# Altium project Super_Hornet_1.0.PrjPcb (part 4 of 5)
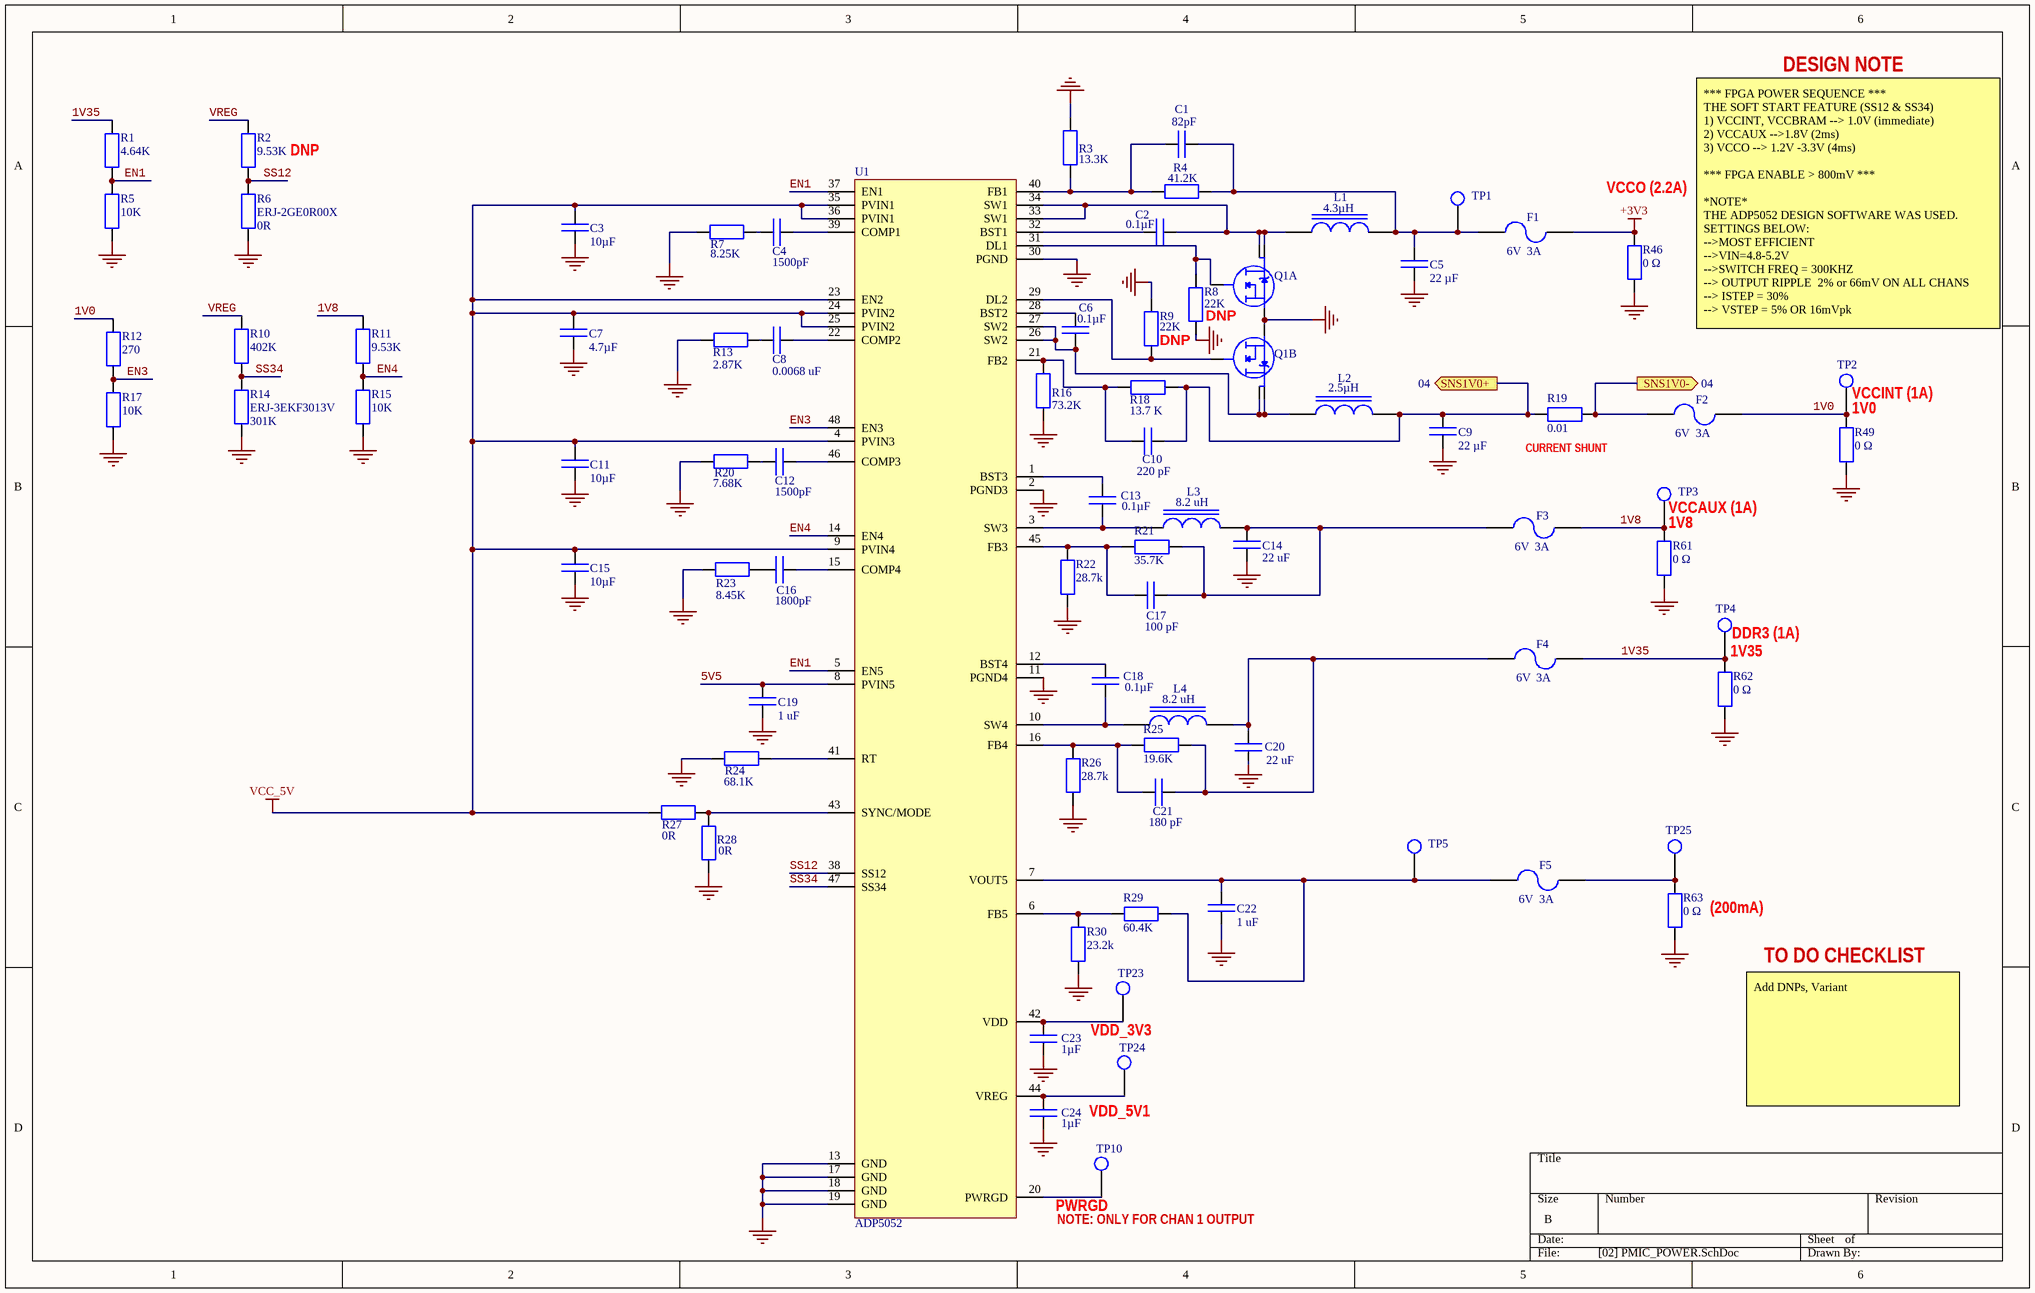
[diagram p5: [02] PMIC_POWER.SchDoc]

## Sheet [02] PMIC_POWER.SchDoc (continued)
### Library data of the parts
C1 = GCM1555C1H820FA16D: CAP CER 82PF 50V C0G/NP0 0402; Manufacturer: Murata; Categories: Capacitors; Tolerance: ±1%; Temperature Coefficient: C0G, NP0; Supplier 1: Digi-Key; Manufacturer Part Number: GCM1555C1H820FA16D; Stock 1: 81409; Pricing 1: 1=0.13, 10=0.095, 100=0.0445, 500=0.0312, 1000=0.0258, 2500=0.024, 5000=0.022 (USD); Series: GCM; Packaging: Digi-Reel®; Part Status: Active; Voltage - Rated: 50V; Operating Temperature: -55°C ~ 125°C; Features: -; Ratings: AEC-Q200; Applications: Automotive; Failure Rate: -; Mounting Type: Surface Mount, MLCC; Package / Case: 0402 (1005 Metric); Size / Dimension: 0.039 L x 0.020 W (1.00mm x 0.50mm); Height - Seated (Max): -; Thickness (Max): 0.022 (0.55mm); Lead Spacing: -; Lead Style: -; ComponentLink1URL: http://search.murata.co.jp/Ceramy/image/img/A01X/G101/ENG/GCM1555C1H820FA16-01.pdf?src-supplier=Digi-Key; ComponentLink1Description: http://search.murata.co.jp/Ceramy/image/img/A01X/G101/ENG/GCM1555C1H820FA16-01.pdf?src-supplier=Digi-Key; Supplier Part Number 1: 490-16436-1-ND
C2 C6 C13 C18 = CC0402KRX7R6BB104: 0402 0.1 uF 10 V ±10 % Tolerance X7R SMT Multilayer Ceramic Capacitor; Manufacturer: Yageo; Product Training Modules: Multilayer Ceramic Capacitors; Catalog Drawings: CC_0402; Featured Product: Commodity Multilayer Ceramic Capacitors – CC Series; Tolerance: ±10%; Voltage - Rated: 10V; Online Catalog: CC Series; Other Names: 311-1345-6; Supplier 1: Digi-Key; Manufacturer Part Number: CC0402KRX7R6BB104; Stock 1: 1324566; Pricing 1: 1=0.1, 10=0.03, 100=0.0134, 500=0.0096, 1000=0.0075, 2500=0.0069, 5000=0.0063 (USD); Standard Package: 1; Category: Capacitors; Family: Ceramic Capacitors; Series: CC; Packaging: Digi-Reel®; Temperature Coefficient: X7R; Mounting Type: Surface Mount, MLCC; Operating Temperature: -55°C ~ 125°C; Applications: General Purpose; Ratings: -; Package / Case: 0402 (1005 Metric); Size / Dimension: 0.039" L x 0.020" W (1.00mm x 0.50mm); Height - Seated (Max): -; Thickness (Max): 0.022" (0.55mm); Lead Spacing: -; Features: -; Lead Style: -; ComponentLink1URL: http://www.mouser.com/ds/2/447/Yageo_UPY-GP_NP0_16V-to-50V_9-358835.pdf?src-supplier=Mouser; ComponentLink1Description: http://www.mouser.com/ds/2/447/Yageo_UPY-GP_NP0_16V-to-50V_9-358835.pdf?src-supplier=Mouser; ComponentLink2URL: https://www.verical.com/server-webapp/html/getDatasheet?partID=317655&src-supplier=Verical; ComponentLink2Description: https://www.verical.com/server-webapp/html/getDatasheet?partID=317655&src-supplier=Verical; ComponentLink3URL: http://www.farnell.com/datasheets/2167236.pdf?src-supplier=Element14; ComponentLink3Description: http://www.farnell.com/datasheets/2167236.pdf?src-supplier=Element14; ComponentLink4URL: http://www.yageo.com/documents/recent/UPY-GPHC_X7R_6.3V-to-50V_18.pdf?src-supplier=Digi-Key; ComponentLink4Description: http://www.yageo.com/documents/recent/UPY-GPHC_X7R_6.3V-to-50V_18.pdf?src-supplier=Digi-Key; ComponentLink5URL: http://www.yageo.com/documents/recent/UPY-GPHC_X7R_6.3V-to-50V_8.pdf?src-supplier=Avnet+Europe; ComponentLink5Description: http://www.yageo.com/documents/recent/UPY-GPHC_X7R_6.3V-to-50V_8.pdf?src-supplier=Avnet+Europe; Supplier Part Number 1: 311-1345-1-ND
C3 C11 C15 = C3216X5R1C106M160AA: CAP CER 10UF 16V X5R 1206; Manufacturer: TDK; PCN Part Number: MLCC Part Number Change 30/Nov/2012; Product Training Modules: High Capacitance Replacement C Series General Applications SEAT, CCV, and TVCL Design Tools Guide to Replacing an Electrolytic Capacitor with an MLCC; Catalog Drawings: C SERIES_1206_1.8; Tolerance: ±20%; Online Catalog: C Series, General Purpose; Other Names: 445-1426-6; Supplier 1: Digi-Key; Manufacturer Part Number: C3216X5R1C106M160AA; Stock 1: 163411; Pricing 1: 1=0.33, 10=0.228, 100=0.129, 500=0.0911, 1000=0.0797 (USD); RoHS Information: RoHS Certificate-MLCC; Standard Package: 1; Category: Capacitors; Family: Ceramic Capacitors; Series: C; Packaging: Digi-Reel®; Voltage - Rated: 16V; Temperature Coefficient: X5R; Mounting Type: Surface Mount, MLCC; Operating Temperature: -55°C ~ 85°C; Applications: General Purpose; Ratings: -; Package / Case: 1206 (3216 Metric); Size / Dimension: 0.126" L x 0.063" W (3.20mm x 1.60mm); Height - Seated (Max): -; Thickness (Max): 0.071" (1.80mm); Lead Spacing: -; Features: -; Lead Style: -; ComponentLink1URL: http://www.farnell.com/datasheets/1359284.pdf?src-supplier=Element14; ComponentLink1Description: http://www.farnell.com/datasheets/1359284.pdf?src-supplier=Element14; ComponentLink2URL: http://www.mouser.com/ds/2/400/lcc_commercial_general_en-837201.pdf?src-supplier=Mouser; ComponentLink2Description: http://www.mouser.com/ds/2/400/lcc_commercial_general_en-837201.pdf?src-supplier=Mouser; ComponentLink3URL: http://www.farnell.com/datasheets/1796654.pdf?src-supplier=Element14; ComponentLink3Description: http://www.farnell.com/datasheets/1796654.pdf?src-supplier=Element14; ComponentLink4URL: https://product.tdk.com/info/en/documents/chara_sheet/C3216X5R1C106M160AA.pdf?src-supplier=Digi-Key; ComponentLink4Description: https://product.tdk.com/info/en/documents/chara_sheet/C3216X5R1C106M160AA.pdf?src-supplier=Digi-Key; Supplier Part Number 1: 445-1426-1-ND
C4 C12 = GCM155R71H152KA37D: CAP CER 1500PF 50V X7R 0402; Manufacturer: Murata; Catalog Drawings: GCM Series_0402; Featured Product: GCM Series Capacitors; Tolerance: ±10%; Dynamic Catalog: GCM Series; Other Names: 490-8000-6; Supplier 1: Digi-Key; Manufacturer Part Number: GCM155R71H152KA37D; Stock 1: 36934; Pricing 1: 1=0.1, 10=0.045, 100=0.0202, 500=0.0144, 1000=0.0113, 2500=0.0103, 5000=0.0095 (USD); Standard Package: 1; Category: Capacitors; Family: Ceramic Capacitors; Series: GCM; Packaging: Digi-Reel®; Voltage - Rated: 50V; Temperature Coefficient: X7R; Mounting Type: Surface Mount, MLCC; Operating Temperature: -55°C ~ 125°C; Applications: Automotive; Ratings: AEC-Q200; Package / Case: 0402 (1005 Metric); Size / Dimension: 0.039" L x 0.020" W (1.00mm x 0.50mm); Height - Seated (Max): -; Thickness (Max): 0.022" (0.55mm); Lead Spacing: -; Features: -; Lead Style: -; ComponentLink1URL: http://psearch.murata.com/capacitor/product/GCM155R71H152KA37%23.pdf?src-supplier=Avnet+Europe; ComponentLink1Description: http://psearch.murata.com/capacitor/product/GCM155R71H152KA37%23.pdf?src-supplier=Avnet+Europe; ComponentLink2URL: http://www.murata.com/~/media/webrenewal/support/library/catalog/products/capacitor/mlcc/c03e.ashx?src-supplier=Digi-Key; ComponentLink2Description: http://www.murata.com/~/media/webrenewal/support/library/catalog/products/capacitor/mlcc/c03e.ashx?src-supplier=Digi-Key; ComponentLink3URL: http://psearch.murata.com/capacitor/product/GCM155R71H152KA37%23.pdf?src-supplier=Avnet; ComponentLink3Description: http://psearch.murata.com/capacitor/product/GCM155R71H152KA37%23.pdf?src-supplier=Avnet; ComponentLink4URL: http://search.murata.co.jp/Ceramy/image/img/A01X/partnumbering_e_02.pdf?src-supplier=Digi-Key; ComponentLink4Description: http://search.murata.co.jp/Ceramy/image/img/A01X/partnumbering_e_02.pdf?src-supplier=Digi-Key; ComponentLink5URL: http://search.murata.co.jp/Ceramy/image/img/w_hinm/S0717E.pdf?src-supplier=Future+Electronics; ComponentLink5Description: http://search.murata.co.jp/Ceramy/image/img/w_hinm/S0717E.pdf?src-supplier=Future+Electronics; ComponentLink6URL: https://www.verical.com/server-webapp/html/getDatasheet?partID=724076&src-supplier=Verical; ComponentLink6Description: https://www.verical.com/server-webapp/html/getDatasheet?partID=724076&src-supplier=Verical; Supplier Part Number 1: 490-8000-1-ND
C5 C9 = 12063D226KAT2A: 1206 25 V 22 uF X5R ±10% Tolerance SMT Multilayer Ceramic Capacitor; Manufacturer: Kyocera AVX; Rated Voltage: 25 V; Supplier 1: Digi-Key; Manufacturer Part Number: 12063D226KAT2A; Stock 1: 100747; Pricing 1: 1=1.15, 10=0.909, 100=0.6814, 500=0.5148, 1000=0.4543 (USD); Case Size/Dimension: 1206; Dielectric: X5R; Tolerance (%): ±10 %; ComponentLink1URL: http://www.avx.com/docs/Catalogs/cx5r.pdf?src-supplier=Future+Electronics; ComponentLink1Description: http://www.avx.com/docs/Catalogs/cx5r.pdf?src-supplier=Future+Electronics; Supplier Part Number 1: 478-9946-1-ND
C7 = C2012X5R1C475K060AC: CAP CER 4.7UF 16V X5R 0805; Manufacturer: TDK; Product Training Modules: C Series General Applications SEAT, CCV, and TVCL Design Tools Guide to Replacing an Electrolytic Capacitor with an MLCC; EDA / CAD Models: Download from Accelerated Designs; Tolerance: ±10%; Online Catalog: C Series, General Purpose; Other Names: 445-14381-6; Supplier 1: Digi-Key; Manufacturer Part Number: C2012X5R1C475K060AC; Stock 1: 30385; Pricing 1: 1=0.5, 10=0.348, 100=0.2087, 500=0.1565, 1000=0.1322 (USD); RoHS Information: RoHS Certificate-MLCC; Standard Package: 1; Category: Capacitors; Family: Ceramic Capacitors; Series: C; Packaging: Digi-Reel®; Voltage - Rated: 16V; Temperature Coefficient: X5R; Mounting Type: Surface Mount, MLCC; Operating Temperature: -55°C ~ 85°C; Applications: General Purpose; Package / Case: 0805 (2012 Metric); Size / Dimension: 0.079" L x 0.049" W (2.00mm x 1.25mm); Thickness (Max): 0.030" (0.75mm); ComponentLink1URL: https://product.tdk.com/en/products/common/pdf/mlcc_partnumber_description.pdf?src-supplier=Digi-Key; ComponentLink1Description: https://product.tdk.com/en/products/common/pdf/mlcc_partnumber_description.pdf?src-supplier=Digi-Key; ComponentLink2URL: https://product.tdk.com/info/en/catalog/spec/mlccspec_commercial_general_midvoltage_en.pdf?src-supplier=Digi-Key; ComponentLink2Description: https://product.tdk.com/info/en/catalog/spec/mlccspec_commercial_general_midvoltage_en.pdf?src-supplier=Digi-Key; Supplier Part Number 1: 445-14381-1-ND
C8 = GCM155R71H682KA55D: CAP CER 6800PF 50V X7R 0402; Manufacturer: Murata; Rad Hard: No; Product Depth: 0.5 mm; Voltage: 50 Vdc; Tolerance: 10 %; Product Length: 1 mm; Supplier 1: Digi-Key; Manufacturer Part Number: GCM155R71H682KA55D; Stock 1: 79110; Pricing 1: 1=0.1, 10=0.05, 100=0.0221, 500=0.0158, 1000=0.0124, 2500=0.0113, 5000=0.0104 (USD); Packaging: Tape & Reel; Package/Case: 0402; Mounting: Surface Mount; Dielectric: X7R; Operating Temperature: -55 to 125 °C; Construction: Flat; Product Height: 0.5 mm; Category: Capacitor Ceramic Multilayer; ComponentLink1URL: http://search.murata.co.jp/Ceramy/image/img/w_hinm/S0717E.pdf?src-supplier=Digi-Key; ComponentLink1Description: http://search.murata.co.jp/Ceramy/image/img/w_hinm/S0717E.pdf?src-supplier=Digi-Key; Supplier Part Number 1: 490-11152-1-ND
C10 = GCM155R71H221KA37D: CAP CER 220PF 50V X7R 0402; Manufacturer: Murata; Rad Hard: No; Product Depth: 0.5 mm; Voltage: 50 Vdc; Tolerance: 10 %; Product Length: 1 mm; Supplier 1: Digi-Key; Manufacturer Part Number: GCM155R71H221KA37D; Stock 1: 139362; Pricing 1: 1=0.1, 10=0.054, 100=0.0241, 500=0.0172, 1000=0.0135, 2500=0.0123, 5000=0.0113 (USD); Packaging: Tape & Reel; Package/Case: 0402; Mounting: Surface Mount; Dielectric: X7R; Operating Temperature: -55 to 125 °C; Construction: Flat; Product Height: 0.5 mm; Category: Capacitor Ceramic Multilayer; ComponentLink1URL: http://psearch.murata.com/capacitor/product/GCM155R71H221KA37%23.pdf?src-supplier=Avnet+Europe; ComponentLink1Description: http://psearch.murata.com/capacitor/product/GCM155R71H221KA37%23.pdf?src-supplier=Avnet+Europe; ComponentLink2URL: http://search.murata.co.jp/Ceramy/image/img/A01X/partnumbering_e_02.pdf?src-supplier=Digi-Key; ComponentLink2Description: http://search.murata.co.jp/Ceramy/image/img/A01X/partnumbering_e_02.pdf?src-supplier=Digi-Key; ComponentLink3URL: https://www.murata.com/~/media/webrenewal/support/library/catalog/products/capacitor/mlcc/c03e.ashx?src-supplier=Avnet; ComponentLink3Description: https://www.murata.com/~/media/webrenewal/support/library/catalog/products/capacitor/mlcc/c03e.ashx?src-supplier=Avnet; Supplier Part Number 1: 490-4912-1-ND
C14 C20 = GRM21BR60J226ME39K: Cap Ceramic 22uF 6.3V X5R 20% SMD 0805 85C Embossed T/R; Manufacturer: Murata; Rad Hard: No; Product Depth: 1.25 mm; Voltage: 6.3 Vdc; Product Length: 2 mm; Supplier 1: Digi-Key; Manufacturer Part Number: GRM21BR60J226ME39K; Stock 1: 32530; Pricing 1: 1=0.5, 10=0.347, 100=0.2082, 500=0.1561, 1000=0.1319, 2500=0.1249, 5000=0.118 (USD); Packaging: Tape & Reel; Package/Case: 0805; Mounting: Surface Mount; Tolerance: 20 %; Dielectric: X5R; Operating Temperature: -55 to 85 °C; Construction: Flat; Product Height: 1.25 mm; Category: Capacitor Ceramic Multilayer; ComponentLink1URL: http://search.murata.co.jp/Ceramy/image/img/A01X/G101/ENG/GRM21BR60J226ME39-01.pdf?src-supplier=Digi-Key; ComponentLink1Description: http://search.murata.co.jp/Ceramy/image/img/A01X/G101/ENG/GRM21BR60J226ME39-01.pdf?src-supplier=Digi-Key; ComponentLink2URL: http://www.mouser.com/ds/2/281/c02e-2905.pdf?src-supplier=Mouser; ComponentLink2Description: http://www.mouser.com/ds/2/281/c02e-2905.pdf?src-supplier=Mouser; ComponentLink3URL: http://psearch.murata.com/capacitor/product/GRM21BR60J226ME39%23.pdf?src-supplier=Avnet; ComponentLink3Description: http://psearch.murata.com/capacitor/product/GRM21BR60J226ME39%23.pdf?src-supplier=Avnet; Supplier Part Number 1: 490-6471-1-ND
C16 = GRM2165C2A182JA01D: CAP CER 1800PF 100V C0G/NP0 0805; Manufacturer: Murata; Catalog Drawings: GRM Series_0805_0.6; Tolerance: ±5%; Temperature Coefficient: C0G, NP0; Supplier 1: Digi-Key; Manufacturer Part Number: GRM2165C2A182JA01D; Stock 1: 2422; Pricing 1: 1=0.19, 10=0.128, 100=0.0649, 500=0.0444, 1000=0.0393 (USD); Standard Package: 4,000; Category: Capacitors; Family: Ceramic Capacitors; Series: GRM; Packaging: Tape & Reel (TR); Voltage - Rated: 100V; Mounting Type: Surface Mount, MLCC; Operating Temperature: -55°C ~ 125°C; Applications: General Purpose; Ratings: -; Package / Case: 0805 (2012 Metric); Size / Dimension: 0.079" L x 0.049" W (2.00mm x 1.25mm); Height - Seated (Max): -; Thickness (Max): 0.028" (0.70mm); Lead Spacing: -; Features: -; Lead Style: -; ComponentLink1URL: http://search.murata.co.jp/Ceramy/image/img/A01X/partnumbering_e_01.pdf?src-supplier=Digi-Key; ComponentLink1Description: http://search.murata.co.jp/Ceramy/image/img/A01X/partnumbering_e_01.pdf?src-supplier=Digi-Key; ComponentLink2URL: http://psearch.murata.com/capacitor/product/GRM2165C2A182JA01%23.pdf?src-supplier=Avnet; ComponentLink2Description: http://psearch.murata.com/capacitor/product/GRM2165C2A182JA01%23.pdf?src-supplier=Avnet; ComponentLink3URL: http://www.mouser.com/ds/2/281/c02e-2905.pdf?src-supplier=Mouser; ComponentLink3Description: http://www.mouser.com/ds/2/281/c02e-2905.pdf?src-supplier=Mouser; Supplier Part Number 1: 490-13368-1-ND
C17 = C0402C101K4GACTU: CAP CER 100PF 16V C0G/NP0 0402; Manufacturer: KEMET; Part # Aliases: C0402C101K4GAC7867; Capacitance - nF: 0.1 nF; Case Height: 0.5 mm; Dielectric: C0G (NP0); Case Length: 1 mm; Class: Class 1; Dissipation Factor DF: 0.1; Tolerance: 10 %; Temperature Coefficient / Code: +/- 30 PPM / C; Type: SMD MLCC C0G 10 - 250 VDC Commercial Grade; Supplier 1: Digi-Key; Manufacturer Part Number: C0402C101K4GACTU; Stock 1: 105221; Pricing 1: 1=0.1, 10=0.025, 100=0.0112, 500=0.008, 1000=0.0063, 2500=0.0057, 5000=0.0052 (USD); Brand: Kemet; Case Code - in: 0402; Case Code - mm: 1005; Dimensions: 0.5 mm W x 1 mm L x 0.5 mm H; Case Width: 0.5 mm; Lead Spacing: 0.3 mm; Factory Pack Quantity: 10000; Voltage Rating: 16 V; Product Category: Multilayer Ceramic Capacitors MLCC - SMD/SMT; RoHS: Details; Minimum Operating Temperature: - 55 C; Maximum Operating Temperature: + 125 C; Product: General Type MLCCs; Operating Temperature Range: - 55 C to + 125 C; Package / Case: 0402 (1005 metric); Packaging: Reel; Series: C0402C; Termination Style: SMD/SMT; Voltage Rating DC: 16 V; ComponentLink1URL: http://www.mouser.com/ds/2/212/KEM_C1003_C0G_SMD-1101588.pdf?src-supplier=Mouser; ComponentLink1Description: http://www.mouser.com/ds/2/212/KEM_C1003_C0G_SMD-1101588.pdf?src-supplier=Mouser; Supplier Part Number 1: 399-7749-1-ND
C19 C22 = C0603C105K8RACTU: CAP CER 1UF 10V X7R 0603; Manufacturer: KEMET; Part # Aliases: C0603C105K8RAC7867; Capacitance - nF: 1000 nF; Case Height: 0.8 mm; Case Length: 1.6 mm; Class: Class 1; Dissipation Factor DF: 5; Tolerance: 10 %; Temperature Coefficient / Code: +/- 15 %; Type: SMD MLCC X7R 6.3 - 250 VDC Commerical Grade; Supplier 1: Digi-Key; Manufacturer Part Number: C0603C105K8RACTU; Stock 1: 413031; Pricing 1: 1=0.1, 10=0.064, 100=0.0285, 500=0.0204, 1000=0.016 (USD); Brand: Kemet; Case Code - in: 0603; Case Code - mm: 1608; Dimensions: 0.8 mm W x 1.6 mm L x 0.8 mm H; Dielectric: X7R; Case Width: 0.8 mm; Factory Pack Quantity: 4000; Voltage Rating: 10 V; Product Category: Multilayer Ceramic Capacitors MLCC - SMD/SMT; RoHS: Details; Voltage Rating DC: 10 V; Minimum Operating Temperature: - 55 C; Maximum Operating Temperature: + 125 C; Product: General Type MLCCs; Operating Temperature Range: - 55 C to + 125 C; Package / Case: 0603 (1608 metric); Packaging: Reel; Series: C0603C; Termination Style: SMD/SMT; ComponentLink1URL: https://www.verical.com/server-webapp/html/getDatasheet?partID=212378&src-supplier=Verical; ComponentLink1Description: https://www.verical.com/server-webapp/html/getDatasheet?partID=212378&src-supplier=Verical; Supplier Part Number 1: 399-11133-1-ND
C21 = C0402C181K5RACTU: CAP CER 180PF 50V X7R 0402; Manufacturer: KEMET; Part # Aliases: C0402C181K5RAC7867; Capacitance - nF: 0.18 nF; Case Height: 0.5 mm; Case Length: 1 mm; Class: Class 1; Dissipation Factor DF: 2.5; Tolerance: 10 %; Temperature Coefficient / Code: +/- 15 %; Type: SMD MLCC X7R 6.3 - 250 VDC Commerical Grade; Supplier 1: Digi-Key; Manufacturer Part Number: C0402C181K5RACTU; Stock 1: 45526; Pricing 1: 1=0.1, 10=0.068, 100=0.0304, 500=0.0217, 1000=0.0171, 2500=0.0155, 5000=0.0143 (USD); Brand: Kemet; Case Code - in: 0402; Case Code - mm: 1005; Dimensions: 0.5 mm W x 1 mm L x 0.5 mm H; Dielectric: X7R; Case Width: 0.5 mm; Lead Spacing: 0.3 mm; Factory Pack Quantity: 10000; Voltage Rating: 50 V; Product Category: Multilayer Ceramic Capacitors MLCC - SMD/SMT; RoHS: Details; Minimum Operating Temperature: - 55 C; Maximum Operating Temperature: + 125 C; Product: General Type MLCCs; Operating Temperature Range: - 55 C to + 125 C; Package / Case: 0402 (1005 metric); Packaging: Reel; Series: C0402C; Termination Style: SMD/SMT; Voltage Rating DC: 50 V; ComponentLink1URL: http://www.farnell.com/datasheets/1807957.pdf?src-supplier=Element14; ComponentLink1Description: http://www.farnell.com/datasheets/1807957.pdf?src-supplier=Element14; ComponentLink2URL: http://www.farnell.com/datasheets/1851736.pdf?src-supplier=Element14; ComponentLink2Description: http://www.farnell.com/datasheets/1851736.pdf?src-supplier=Element14; Supplier Part Number 1: 399-15305-1-ND
C23 C24 = CC0402KRX5R5BB105: CAP CER 1UF 6.3V X5R 0402; Manufacturer: Yageo; Product Training Modules: Multilayer Ceramic Capacitors; Catalog Drawings: CC_0402; Featured Product: Yageo - High Capacitance MLCC Commodity Multilayer Ceramic Capacitors – CC Series; Tolerance: ±10%; Online Catalog: CC Series; Other Names: 311-1438-6; Supplier 1: Digi-Key; Manufacturer Part Number: CC0402KRX5R5BB105; Stock 1: 37230107; Pricing 1: 1=0.1, 10=0.052, 100=0.0231, 500=0.0165, 1000=0.013, 2500=0.0118, 5000=0.0109 (USD); Standard Package: 1; Category: Capacitors; Family: Ceramic Capacitors; Series: CC; Packaging: Digi-Reel®; Voltage - Rated: 6.3V; Temperature Coefficient: X5R; Mounting Type: Surface Mount, MLCC; Operating Temperature: -55°C ~ 85°C; Applications: General Purpose; Ratings: -; Size / Dimension: 0.039" L x 0.020" W (1.00mm x 0.50mm); Height - Seated (Max): -; Thickness (Max): 0.022" (0.55mm); Lead Spacing: -; Features: -; Lead Style: -; ComponentLink1URL: http://www.farnell.com/datasheets/70765.pdf?src-supplier=Farnell; ComponentLink1Description: http://www.farnell.com/datasheets/70765.pdf?src-supplier=Farnell; ComponentLink2URL: http://www.yageo.com/documents/recent/UPY-GPHC_X5R_4V-to-50V_25.pdf?src-supplier=Digi-Key; ComponentLink2Description: http://www.yageo.com/documents/recent/UPY-GPHC_X5R_4V-to-50V_25.pdf?src-supplier=Digi-Key; ComponentLink3URL: http://www.farnell.com/datasheets/2167237.pdf?src-supplier=Element14; ComponentLink3Description: http://www.farnell.com/datasheets/2167237.pdf?src-supplier=Element14; ComponentLink4URL: http://www.yageo.com/documents/recent/UPY-GPHC_X5R_4V-to-50V_12.pdf?src-supplier=Avnet+Europe; ComponentLink4Description: http://www.yageo.com/documents/recent/UPY-GPHC_X5R_4V-to-50V_12.pdf?src-supplier=Avnet+Europe; ComponentLink5URL: http://www.farnell.com/datasheets/1359354.pdf?src-supplier=Element14; ComponentLink5Description: http://www.farnell.com/datasheets/1359354.pdf?src-supplier=Element14; ComponentLink6URL: http://www.farnell.com/datasheets/70765.pdf?src-supplier=Element14; ComponentLink6Description: http://www.farnell.com/datasheets/70765.pdf?src-supplier=Element14; ComponentLink7URL: http://www.yageo.com/documents/recent/UPY-GPHC_X5R_4V-to-50V_12.pdf?src-supplier=Avnet; ComponentLink7Description: http://www.yageo.com/documents/recent/UPY-GPHC_X5R_4V-to-50V_12.pdf?src-supplier=Avnet; Supplier Part Number 1: 311-1438-1-ND; Package / Case: 0402 (1005 Metric)
F1-F5 = MF-NSML300-2: PTC FUSE 3A HOLD 6V 1206; Manufacturer: Bourns; Categories: Circuit Protection; Type: Polymeric; Current - Max: 50A; Current - Trip (It): 6A; Resistance - Initial (Ri) (Min): 2.5 mOhms; Resistance - Post Trip (R1) (Max): 20 mOhms; Approvals: cURus, TUV; Time to Trip: 4s; Supplier 1: Digi-Key; Manufacturer Part Number: MF-NSML300-2; Stock 1: 1383; Pricing 1: 1=0.95, 5=0.92, 10=0.861, 50=0.7128, 100=0.594, 250=0.5792, 500=0.4901, 1000=0.4307 (USD); Series: Multifuse®, MF-NSML; Packaging: Cut Tape (CT); Part Status: Active; Operating Temperature: -40°C ~ 85°C; Ratings: -; Mounting Type: Surface Mount; Package / Case: 1206 (3216 Metric), Concave; Size / Dimension: 0.128 L x 0.063 W (3.25mm x 1.60mm); Height - Seated (Max): -; Thickness (Max): 0.024 (0.60mm); Lead Spacing: -; ComponentLink1URL: https://www.bourns.com/docs/Product-Datasheets/mfnsml.pdf?src-supplier=Digi-Key; ComponentLink1Description: https://www.bourns.com/docs/Product-Datasheets/mfnsml.pdf?src-supplier=Digi-Key; ComponentLink2URL: http://www.bourns.com/docs/Product-Datasheets/mfnsml.pdf?src-supplier=Digi-Key; ComponentLink2Description: http://www.bourns.com/docs/Product-Datasheets/mfnsml.pdf?src-supplier=Digi-Key; ComponentLink3URL: http://www.farnell.com/datasheets/2339790.pdf?src-supplier=Farnell; ComponentLink3Description: http://www.farnell.com/datasheets/2339790.pdf?src-supplier=Farnell; Supplier Part Number 1: MF-NSML300-2CT-ND
L1 = 7443552430: FIXED IND 4.3UH 8A 14.1 MOHM SMD; Manufacturer: Wurth Electronics; Catalog Drawings: 7443552 Series Top 7443552 Series Side 7443552 Series Bottom; Design Resources: Spice Model Library; Featured Product: Flat Wire High Current Inductors WE-HCI – SMD Flat Wire High Current Inductor; 3D Model: WE-HCI_1040_7443552.igs WE-HCI_1040_7443552.stp; Type: Wirewound; Tolerance: ±20%; Shielding: Shielded; Frequency - Self Resonant: 33MHz; Frequency - Test: 100kHz; Online Catalog: WE-HCI Series; Kits: 732-1921-ND / - KIT INDUCTOR HC/HCA SMALL SIZES; Related Products: 122-1853-ND / - IC SOC CORTEX-A9 ARTIX-7 225BGA / 122-1852-ND / - IC SOC CORTEX-A9 ARTIX-7 400BGA / 122-1963-ND / - IC SOC CORTEX-A9 ARTIX-7 400BGA / 122-1855-ND / - IC SOC CORTEX-A9 ARTIX-7 225BGA / 122-1854-ND / - IC SOC CORTEX-A9 ARTIX-7 400BGA / 497-8821-2-ND / - IC REG BUCK ADJ 4A SYNC 16HTSSOP / 497-8821-1-ND / - IC REG BUCK ADJ 4A SYNC 16HTSSOP / 497-8821-6-ND / - IC REG BUCK ADJ 4A SYNC 16HTSSOP / L5989D-ND / - IC REG BUCK ADJ 4A SYNC 16HTSSOP / XC7Z010-1CLG225I-ND / - IC SOC CORTEX-A9 ARTIX-7 225BGA / XC7Z010-2CLG225E-ND / - IC SOC CORTEX-A9 ARTIX-7 225BGA / XC7Z010-2CLG400E-ND / - IC SOC CORTEX-A9 ARTIX-7 400BGA / XC7Z010-3CLG225E-ND / - IC SOC CORTEX-A9 ARTIX-7 225BGA / XC7Z010-3CLG400E-ND / - IC SOC CORTEX-A9 ARTIX-7 400BGA; Other Names: 732-1136-1; Supplier 1: Digi-Key; Manufacturer Part Number: 7443552430; Stock 1: 1440; Pricing 1: 1=2.67, 10=2.621, 50=2.419, 100=2.318 (USD); Standard Package: 1; Category: Inductors, Coils, Chokes; Family: Fixed Inductors; Series: WE-HCI; Packaging: Cut Tape (CT); Current Rating: 8A; Current - Saturation: 8A; DC Resistance (DCR): 14.1 mOhm; Operating Temperature: -40°C ~ 155°C; Mounting Type: Surface Mount; Package / Case: Nonstandard; Size / Dimension: 0.413" L x 0.402" W (10.50mm x 10.20mm); Height - Seated (Max): 0.165" (4.20mm); ComponentLink1URL: https://katalog.we-online.de/pbs/datasheet/7443552430.pdf?src-supplier=Digi-Key; ComponentLink1Description: https://katalog.we-online.de/pbs/datasheet/7443552430.pdf?src-supplier=Digi-Key; ComponentLink2URL: http://documents.rs-components.com/techlib://itc_doclist_GB.htm?stockno=7362080&src-supplier=RSComponents; ComponentLink2Description: http://documents.rs-components.com/techlib://itc_doclist_GB.htm?stockno=7362080&src-supplier=RSComponents; ComponentLink3URL: http://www.farnell.com/datasheets/1735722.pdf?src-supplier=Element14; ComponentLink3Description: http://www.farnell.com/datasheets/1735722.pdf?src-supplier=Element14; ComponentLink4URL: https://www.distrelec.biz/Web/Downloads/a_/de/np7443552430_data_DE.pdf?mime=application%2Fpdf&src-supplier=Distrelec; ComponentLink4Description: https://www.distrelec.biz/Web/Downloads/a_/de/np7443552430_data_DE.pdf?mime=application%2Fpdf&src-supplier=Distrelec; ComponentLink5URL: http://www.mouser.com/ds/2/445/7443552430-538587.pdf?src-supplier=Mouser; ComponentLink5Description: http://www.mouser.com/ds/2/445/7443552430-538587.pdf?src-supplier=Mouser; Supplier Part Number 1: 732-1136-1-ND
L2 = 7447798250: IND 2.5UH 13.7A 4.95 MOHM; Manufacturer: Wurth Electronics; Product Training Modules: High Current Inductors with Flatwire Technology for Low Wire Losses; Catalog Drawings: 744779 Series Bottom 744779 Series Top 744779 Series_6.4mm Height-Side; Design Resources: Spice Model Library; 3D Model: 7447798zzz.igs 7447798zzz.stp; Type: Wirewound; Material - Core: Metal Composite; Tolerance: ±30%; Current - Saturation: 10.1A; Shielding: Shielded; DC Resistance (DCR): 4.95 mOhm Max; Frequency - Self Resonant: 57MHz; Frequency - Test: 100kHz; Online Catalog: WE-PDF Series; Related Products: NCP3170ADR2GOSTR-ND / - IC REG BUCK ADJ 3A SYNC 8SOIC / NCP3170ADR2GOSCT-ND / - IC REG BUCK ADJ 3A SYNC 8SOIC / NCP3170ADR2GOSDKR-ND / - IC REG BUCK ADJ 3A SYNC 8SOIC / NCP3170BDR2GOSTR-ND / - IC REG BUCK ADJ 3A SYNC 8SOIC / NCP3170BDR2GOSCT-ND / - IC REG BUCK ADJ 3A SYNC 8SOIC / NCP3170BDR2GOSDKR-ND / - IC REG BUCK ADJ 3A SYNC 8SOIC; Other Names: 732-2418-6; Supplier 1: Digi-Key; Manufacturer Part Number: 7447798250; Stock 1: 78; Pricing 1: 1=3.34, 10=3.086, 50=2.979, 100=2.873, 250=2.554 (USD); Standard Package: 1; Category: Inductors, Coils, Chokes; Family: Fixed Inductors; Series: WE-PDF; Packaging: Digi-Reel®; Current Rating: 13.7A; Operating Temperature: -40°C ~ 150°C; Mounting Type: Surface Mount; Package / Case: Nonstandard; Size / Dimension: 0.402" L x 0.402" W (10.20mm x 10.20mm); Height - Seated (Max): 0.252" (6.40mm); ComponentLink1URL: https://katalog.we-online.de/pbs/datasheet/7447798250.pdf?src-supplier=Digi-Key; ComponentLink1Description: https://katalog.we-online.de/pbs/datasheet/7447798250.pdf?src-supplier=Digi-Key; ComponentLink2URL: http://katalog.we-online.de/pbs/datasheet/7447798250.pdf?src-supplier=Digi-Key; ComponentLink2Description: http://katalog.we-online.de/pbs/datasheet/7447798250.pdf?src-supplier=Digi-Key; ComponentLink3URL: http://www.mouser.com/ds/2/445/7447798250-539040.pdf?src-supplier=Mouser; ComponentLink3Description: http://www.mouser.com/ds/2/445/7447798250-539040.pdf?src-supplier=Mouser; ComponentLink4URL: http://documents.rs-components.com/techlib://itc_doclist_GB.htm?stockno=7444965&src-supplier=RSComponents; ComponentLink4Description: http://documents.rs-components.com/techlib://itc_doclist_GB.htm?stockno=7444965&src-supplier=RSComponents; ComponentLink5URL: http://www.farnell.com/datasheets/1915042.pdf?src-supplier=Farnell; ComponentLink5Description: http://www.farnell.com/datasheets/1915042.pdf?src-supplier=Farnell; Supplier Part Number 1: 732-2418-1-ND
L3 L4 = XAL5050-822MEB: Power inductor, shielded, 20% tol, SMT, RoHS, halogen f; Manufacturer: Coilcraft; Part # Aliases: XAL5050-822MEC; Case Height: 5.1 mm; Case Length: 5.68 mm; Case Width: 5.48 mm; Core Material: Composite; Maximum DC Current: 6.1 A; Maximum DC Resistance: 34.95 mOhms; Self Resonant Frequency: 18 MHz; Test Frequency: 100 kHz; Supplier 1: Mouser; Manufacturer Part Number: XAL5050-822MEB; Stock 1: 1232; Pricing 1: 1=2.57, 10=2.3, 50=2.2, 100=2.2, 250=2.2, 500=1.44 (USD); Brand: Coilcraft; Dimensions: 5.48 mm W x 5.68 mm L x 5.1 mm H; Operating Temperature Range: - 40 C to + 125 C; Packaging: Reel; Factory Pack Quantity: 20; Product Category: Fixed Inductors; RoHS: Details; Tolerance: 20 %; Shielding: Shielded; Termination Style: SMD/SMT; Product: Power Inductors; Series: XAL5050; Supplier Part Number 1: 994-XAL5050-822MEB
Q1 = IRF8910: MOSFET; Transistor Polarity:-; Continuous Drain Current Id:-; Drain Source Voltage Vds:-; On Resistance Rds(on):-; Rds(on) Test Voltage Vgs:-; Threshold Voltage Vgs:-; Power Dissipation Pd:-; Operating Temperature Max:- ;RoHS Compliant: No; Manufacturer: International Rectifier; Supplier 1: Digi-Key; Manufacturer Part Number: IRF8910; Stock 1: 0; Pricing 1: 1=0.85, 10=0.763, 25=0.7248, 100=0.5435, 250=0.5383, 500=0.4607, 1000=0.3753 (USD); ComponentLink1URL: http://datasheet.iiic.cc/international_rectifier/IRF8910.pdf?src-supplier=IIIC; ComponentLink1Description: http://datasheet.iiic.cc/international_rectifier/IRF8910.pdf?src-supplier=IIIC; Supplier Part Number 1: IRF8910PBFCT-ND
R1 = ERJ-3EKF4641V: RES SMD 4.64K OHM 1% 1/10W 0603; Manufacturer: Panasonic; Resistor Element Type: Thick Film; Product Range: PANASONIC - ERJ Series; Power Rating: 100mW; Resistor Case Style: 0603 [1608 Metric]; Temperature Coefficient: ± 100ppm/°C; Voltage Rating: 75V; SVHC: Diboron trioxide (19-Dec-2012); SVHC (Secondary): Lead monoxide (lead oxide) (19-Dec-2012); Supplier 1: Digi-Key; Manufacturer Part Number: ERJ-3EKF4641V; Stock 1: 27560; Pricing 1: 1=0.1, 10=0.054, 100=0.0219, 1000=0.0099, 2500=0.0086 (USD); Resistance Tolerance: ± 1%; Resistor Element Material: Thick Film; Packaging: Cut Tape; MSL: (Not Applicable); Resistor Mounting: SMD; ComponentLink1URL: http://www.farnell.com/datasheets/426256.pdf?src-supplier=Farnell; ComponentLink1Description: http://www.farnell.com/datasheets/426256.pdf?src-supplier=Farnell; ComponentLink2URL: http://www.farnell.com/datasheets/426256.pdf?src-supplier=Element14; ComponentLink2Description: http://www.farnell.com/datasheets/426256.pdf?src-supplier=Element14; ComponentLink3URL: https://www.alliedelec.com/m/d/623f45ff1957d936ff56d46fd1c28cac.pdf?src-supplier=Allied+Electronics; ComponentLink3Description: https://www.alliedelec.com/m/d/623f45ff1957d936ff56d46fd1c28cac.pdf?src-supplier=Allied+Electronics; ComponentLink4URL: http://www.mouser.com/ds/2/315/AOA0000CE2-37512.pdf?src-supplier=Mouser; ComponentLink4Description: http://www.mouser.com/ds/2/315/AOA0000CE2-37512.pdf?src-supplier=Mouser; Supplier Part Number 1: P4.64KHCT-ND
R2 R11 = ERJ-3EKF9531V: RES SMD 9.53K OHM 1% 1/10W 0603; Manufacturer: Panasonic; EDA / CAD Models: Download from Accelerated Designs; Power (Watts): 0.1W, 1/10W; Temperature Coefficient: ±100ppm/°C; Online Catalog: ERJ Series; Kits: RSM3H-ND  - RES KIT 1K-9.76K 1/10W 4800PCS; Other Names: ERJ-3EKF9531 ERJ3EKF9531 P9.53KHCT; Supplier 1: Digi-Key; Manufacturer Part Number: ERJ-3EKF9531V; Stock 1: 49914; Pricing 1: 1=0.1, 10=0.042, 100=0.0169, 1000=0.0076, 2500=0.0066 (USD); Standard Package: 1; Category: Resistors; Family: Chip Resistor - Surface Mount; Series: ERJ; Packaging: Cut Tape (CT); Tolerance: ±1%; Composition: Thick Film; Features: Automotive AEC-Q200; Operating Temperature: -55°C ~ 155°C; Package / Case: 0603 (1608 Metric); Supplier Device Package: 0603; Size / Dimension: 0.063" L x 0.031" W (1.60mm x 0.80mm); Height: 0.022" (0.55mm); Number of Terminations: 2; ComponentLink1URL: http://www.farnell.com/datasheets/1678782.pdf?src-supplier=Element14; ComponentLink1Description: http://www.farnell.com/datasheets/1678782.pdf?src-supplier=Element14; ComponentLink2URL: http://industrial.panasonic.com/www-data/pdf/AOA0000/AOA0000CE2.pdf?src-supplier=Avnet+Asia; ComponentLink2Description: http://industrial.panasonic.com/www-data/pdf/AOA0000/AOA0000CE2.pdf?src-supplier=Avnet+Asia; ComponentLink3URL: http://www.farnell.com/datasheets/426256.pdf?src-supplier=Element14; ComponentLink3Description: http://www.farnell.com/datasheets/426256.pdf?src-supplier=Element14; ComponentLink4URL: http://www.farnell.com/datasheets/1911175.pdf?src-supplier=Farnell; ComponentLink4Description: http://www.farnell.com/datasheets/1911175.pdf?src-supplier=Farnell; ComponentLink5URL: https://www.alliedelec.com/m/d/623f45ff1957d936ff56d46fd1c28cac.pdf?src-supplier=Allied+Electronics; ComponentLink5Description: https://www.alliedelec.com/m/d/623f45ff1957d936ff56d46fd1c28cac.pdf?src-supplier=Allied+Electronics; ComponentLink6URL: http://industrial.panasonic.com/www-data/pdf/AOA0000/AOA0000CE2.pdf?src-supplier=Avnet; ComponentLink6Description: http://industrial.panasonic.com/www-data/pdf/AOA0000/AOA0000CE2.pdf?src-supplier=Avnet; Supplier Part Number 1: P9.53KHCT-ND
R3 = CRCW080513K3FKEA: RES SMD 13.3K OHM 1% 1/8W 0805; Manufacturer: Vishay; EDA / CAD Models: Download from Accelerated Designs; Power (Watts): 0.125W, 1/8W; Temperature Coefficient: ±100ppm/°C; Online Catalog: CRCW - Automotive Series; Kits: 541-1420-ND  - RESISTOR KIT 0-1M 1/8W 6100PCS; Other Names: 541-13.3KCCT; Supplier 1: Digi-Key; Manufacturer Part Number: CRCW080513K3FKEA; Stock 1: 38417; Pricing 1: 1=0.1, 10=0.062, 100=0.0254, 1000=0.0114, 2500=0.0099 (USD); Standard Package: 10; Category: Resistors; Family: Chip Resistor - Surface Mount; Series: CRCW; Packaging: Cut Tape (CT); Tolerance: ±1%; Composition: Thick Film; Features: Automotive AEC-Q200; Operating Temperature: -55°C ~ 155°C; Package / Case: 0805 (2012 Metric); Supplier Device Package: 0805 (2012 Metric); Size / Dimension: 0.079" L x 0.049" W (2.00mm x 1.25mm); Height: 0.020" (0.50mm); Number of Terminations: 2; ComponentLink1URL: http://www.vishay.com/docs/20035/dcrcwe3.pdf?src-supplier=Digi-Key; ComponentLink1Description: http://www.vishay.com/docs/20035/dcrcwe3.pdf?src-supplier=Digi-Key; ComponentLink2URL: http://www.farnell.com/datasheets/1697337.pdf?src-supplier=Element14; ComponentLink2Description: http://www.farnell.com/datasheets/1697337.pdf?src-supplier=Element14; ComponentLink3URL: http://www.vishay.com/docs/20035/dcrcwe3.pdf?src-supplier=Avnet; ComponentLink3Description: http://www.vishay.com/docs/20035/dcrcwe3.pdf?src-supplier=Avnet; ComponentLink4URL: http://www.mouser.com/ds/2/427/dcrcwe3-109170.pdf?src-supplier=Mouser; ComponentLink4Description: http://www.mouser.com/ds/2/427/dcrcwe3-109170.pdf?src-supplier=Mouser; ComponentLink5URL: http://www.vishay.com/docs/20035/dcrcwe3.pdf?src-supplier=Avnet+Europe; ComponentLink5Description: http://www.vishay.com/docs/20035/dcrcwe3.pdf?src-supplier=Avnet+Europe; ComponentLink6URL: http://uk.rs-online.com/webdocs/0d98/0900766b80d98b26.pdf?src-supplier=RSComponents; ComponentLink6Description: http://uk.rs-online.com/webdocs/0d98/0900766b80d98b26.pdf?src-supplier=RSComponents; ComponentLink7URL: http://www.vishay.com/docs/20008/dcrcw.pdf?src-supplier=Future+Electronics; ComponentLink7Description: http://www.vishay.com/docs/20008/dcrcw.pdf?src-supplier=Future+Electronics; ComponentLink8URL: https://www.alliedelec.com/m/d/0c934d6939ccefa68dbe0b96d821c8cf.pdf?src-supplier=Allied+Electronics; ComponentLink8Description: https://www.alliedelec.com/m/d/0c934d6939ccefa68dbe0b96d821c8cf.pdf?src-supplier=Allied+Electronics; ComponentLink9URL: http://www.farnell.com/datasheets/2111203.pdf?src-supplier=Element14; ComponentLink9Description: http://www.farnell.com/datasheets/2111203.pdf?src-supplier=Element14; Supplier Part Number 1: 541-13.3KCCT-ND
R4 = CRCW080541K2FKEA: RES SMD 41.2K OHM 1% 1/8W 0805; Manufacturer: Vishay; Brand: Vishay / Dale; Power Rating: 125 mW (1/8 W); Temperature Coefficient: 100 PPM / K; Voltage Rating: 150 V; Case Height: 0.45 mm; Case Length: 2 mm; Case Width: 1.25 mm; Unit Weight: 0.000194 oz; Supplier 1: Digi-Key; Manufacturer Part Number: CRCW080541K2FKEA; Stock 1: 6153; Pricing 1: 1=0.1, 10=0.062, 100=0.0254, 1000=0.0114, 2500=0.0099 (USD); Product Category: Thick Film Resistors - SMD; RoHS: Details; Tolerance: 1 %; Case Code - in: 0805; Case Code - mm: 2012; Operating Temperature Range: - 55 C to + 155 C; Package / Case: 0805 (2012 metric); Packaging: Reel; Product: Thick Film Resistors SMD; Series: CRCW; Factory Pack Quantity: 5000; ComponentLink1URL: http://www.vishay.com/docs/20035/dcrcwe3.pdf?src-supplier=Digi-Key; ComponentLink1Description: http://www.vishay.com/docs/20035/dcrcwe3.pdf?src-supplier=Digi-Key; ComponentLink2URL: http://www.farnell.com/datasheets/2049244.pdf?src-supplier=Element14; ComponentLink2Description: http://www.farnell.com/datasheets/2049244.pdf?src-supplier=Element14; ComponentLink3URL: http://www.vishay.com/docs/20035/dcrcwe3.pdf?src-supplier=Future+Electronics; ComponentLink3Description: http://www.vishay.com/docs/20035/dcrcwe3.pdf?src-supplier=Future+Electronics; ComponentLink4URL: http://www.vishay.com/docs/20035/dcrcwe3.pdf?src-supplier=Avnet; ComponentLink4Description: http://www.vishay.com/docs/20035/dcrcwe3.pdf?src-supplier=Avnet; ComponentLink5URL: http://www.mouser.com/ds/2/427/dcrcwe3-109170.pdf?src-supplier=Mouser; ComponentLink5Description: http://www.mouser.com/ds/2/427/dcrcwe3-109170.pdf?src-supplier=Mouser; ComponentLink6URL: http://www.farnell.com/datasheets/1697337.pdf?src-supplier=Element14; ComponentLink6Description: http://www.farnell.com/datasheets/1697337.pdf?src-supplier=Element14; Supplier Part Number 1: 541-41.2KCCT-ND
R5 R15 R17 = ERJ-3EKF1002V: RES SMD 10K OHM 1% 1/10W 0603; Manufacturer: Panasonic; Rated Power: 0.1 W; Temp Coefficient: 100 ppm/C; Supplier 1: Digi-Key; Manufacturer Part Number: ERJ-3EKF1002V; Stock 1: 2668173; Pricing 1: 1=0.1, 10=0.06, 100=0.0244, 1000=0.0109, 2500=0.0095 (USD); Size Code: 0603; Tolerance (%): 1 %; ComponentLink1URL: https://industrial.panasonic.com/cdbs/www-data/pdf/RDA0000/DMA0000COL11.pdf?src-supplier=Avnet+Asia; ComponentLink1Description: https://industrial.panasonic.com/cdbs/www-data/pdf/RDA0000/DMA0000COL11.pdf?src-supplier=Avnet+Asia; ComponentLink2URL: http://www.farnell.com/datasheets/1911175.pdf?src-supplier=Element14; ComponentLink2Description: http://www.farnell.com/datasheets/1911175.pdf?src-supplier=Element14; ComponentLink3URL: https://industrial.panasonic.com/cdbs/www-data/pdf/RDA0000/DMA0000COL11.pdf?src-supplier=Avnet; ComponentLink3Description: https://industrial.panasonic.com/cdbs/www-data/pdf/RDA0000/DMA0000COL11.pdf?src-supplier=Avnet; ComponentLink4URL: http://industrial.panasonic.com/www-data/pdf/AOA0000/AOA0000CE2.pdf?src-supplier=Avnet+Europe; ComponentLink4Description: http://industrial.panasonic.com/www-data/pdf/AOA0000/AOA0000CE2.pdf?src-supplier=Avnet+Europe; ComponentLink5URL: http://industrial.panasonic.com/www-data/pdf/AOA0000/AOA0000CE2.pdf?src-supplier=Avnet; ComponentLink5Description: http://industrial.panasonic.com/www-data/pdf/AOA0000/AOA0000CE2.pdf?src-supplier=Avnet; ComponentLink6URL: https://industrial.panasonic.com/cdbs/www-data/pdf/RDA0000/DMA0000COL11.pdf?src-supplier=Mouser; ComponentLink6Description: https://industrial.panasonic.com/cdbs/www-data/pdf/RDA0000/DMA0000COL11.pdf?src-supplier=Mouser; ComponentLink7URL: https://industrial.panasonic.com/cdbs/www-data/pdf/RDA0000/DMA0000COL11.pdf?src-supplier=Allied+Electronics; ComponentLink7Description: https://industrial.panasonic.com/cdbs/www-data/pdf/RDA0000/DMA0000COL11.pdf?src-supplier=Allied+Electronics; Supplier Part Number 1: P10.0KHDKR-ND
R6 R27 R28 = ERJ-2GE0R00X: RES SMD 0 OHM JUMPER 1/10W 0402; Manufacturer: Panasonic; EDA / CAD Models: Download from Accelerated Designs; Power (Watts): 0.1W, 1/10W; Online Catalog: ERJ Series; Other Names: P0.0JDKR; Supplier 1: Digi-Key; Manufacturer Part Number: ERJ-2GE0R00X; Stock 1: 11761060; Pricing 1: 1=0.1, 10=0.027, 25=0.0196, 50=0.015, 100=0.0111, 250=0.0085, 500=0.0068, 1000=0.005, 5000=0.0036 (USD); Standard Package: 1; Category: Resistors; Family: Chip Resistor - Surface Mount; Series: ERJ; Packaging: Digi-Reel®; Tolerance: Jumper; Composition: Thick Film; Features: Automotive AEC-Q200; Temperature Coefficient: -; Operating Temperature: -55°C ~ 155°C; Package / Case: 0402 (1005 Metric); Supplier Device Package: 0402; Size / Dimension: 0.039" L x 0.020" W (1.00mm x 0.50mm); Height: 0.016" (0.40mm); Number of Terminations: 2; ComponentLink1URL: http://industrial.panasonic.com/www-data/pdf/AOA0000/AOA0000CE1.pdf?src-supplier=Avnet; ComponentLink1Description: http://industrial.panasonic.com/www-data/pdf/AOA0000/AOA0000CE1.pdf?src-supplier=Avnet; ComponentLink2URL: http://www.alliedelec.com/m/d/51cd0790071e1666bdb9d00c57fcf960.pdf?src-supplier=Allied+Electronics; ComponentLink2Description: http://www.alliedelec.com/m/d/51cd0790071e1666bdb9d00c57fcf960.pdf?src-supplier=Allied+Electronics; ComponentLink3URL: http://industrial.panasonic.com/www-data/pdf/AOA0000/AOA0000CE1.pdf?src-supplier=Avnet+Europe; ComponentLink3Description: http://industrial.panasonic.com/www-data/pdf/AOA0000/AOA0000CE1.pdf?src-supplier=Avnet+Europe; ComponentLink4URL: http://industrial.panasonic.com/cdbs/www-data/pdf/RDA0000/AOA0000C301.pdf?src-supplier=Farnell; ComponentLink4Description: http://industrial.panasonic.com/cdbs/www-data/pdf/RDA0000/AOA0000C301.pdf?src-supplier=Farnell; ComponentLink5URL: http://www.farnell.com/datasheets/1678796.pdf?src-supplier=Element14; ComponentLink5Description: http://www.farnell.com/datasheets/1678796.pdf?src-supplier=Element14; ComponentLink6URL: http://www.farnell.com/datasheets/2059623.pdf?src-supplier=Element14; ComponentLink6Description: http://www.farnell.com/datasheets/2059623.pdf?src-supplier=Element14; Supplier Part Number 1: P0.0JDKR-ND
R7 = ERJ-6ENF8251V: RES SMD 8.25K OHM 1% 1/8W 0805; Manufacturer: Panasonic; Resistor Element Type: Thick Film; Temperature Coefficient: ± 100ppm/°C; Voltage Rating: 150V; SVHC: To Be Advised; Product Range: PANASONIC - ERJ Series Thick Film Chip Resistors; Power Rating: 125mW; Resistor Case Style: 0805 ^2012 Metric]; Supplier 1: Digi-Key; Manufacturer Part Number: ERJ-6ENF8251V; Stock 1: 31520; Pricing 1: 1=0.1, 10=0.072, 100=0.0275, 1000=0.0121, 2500=0.0105 (USD); Packaging: Full Reel; Resistance Tolerance: ± 1%; ComponentLink1URL: http://industrial.panasonic.com/www-data/pdf/AOA0000/AOA0000CE2.pdf?src-supplier=Avnet+Europe; ComponentLink1Description: http://industrial.panasonic.com/www-data/pdf/AOA0000/AOA0000CE2.pdf?src-supplier=Avnet+Europe; ComponentLink2URL: http://www.jameco.com/Jameco/Products/ProdDS/1989586.pdf?src-supplier=Jameco; ComponentLink2Description: http://www.jameco.com/Jameco/Products/ProdDS/1989586.pdf?src-supplier=Jameco; ComponentLink3URL: http://www.farnell.com/datasheets/426256.pdf?src-supplier=Element14; ComponentLink3Description: http://www.farnell.com/datasheets/426256.pdf?src-supplier=Element14; ComponentLink4URL: https://www.verical.com/server-webapp/html/getDatasheet?partID=29070&src-supplier=Verical; ComponentLink4Description: https://www.verical.com/server-webapp/html/getDatasheet?partID=29070&src-supplier=Verical; ComponentLink5URL: http://www.farnell.com/datasheets/1678782.pdf?src-supplier=Element14; ComponentLink5Description: http://www.farnell.com/datasheets/1678782.pdf?src-supplier=Element14; ComponentLink6URL: http://www.farnell.com/datasheets/1911175.pdf?src-supplier=Farnell; ComponentLink6Description: http://www.farnell.com/datasheets/1911175.pdf?src-supplier=Farnell; ComponentLink7URL: http://industrial.panasonic.com/cdbs/www-data/pdf/RDA0000/AOA0000C304.pdf?src-supplier=Farnell; ComponentLink7Description: http://industrial.panasonic.com/cdbs/www-data/pdf/RDA0000/AOA0000C304.pdf?src-supplier=Farnell; Supplier Part Number 1: P8.25KCCT-ND
R8 R9 = CRCW040222K0FKED: RES SMD 22K OHM 1% 1/16W 0402; Manufacturer: Vishay; Brand: Vishay / Dale; Power Rating: 63 mW; Temperature Coefficient: 100 PPM / K; Voltage Rating: 50 V; Case Height: 0.35 mm; Case Length: 1 mm; Case Width: 0.5 mm; Unit Weight: 0.000023 oz; Supplier 1: Digi-Key; Manufacturer Part Number: CRCW040222K0FKED; Stock 1: 6568; Pricing 1: 1=0.1, 10=0.036, 100=0.0146, 1000=0.0066, 2500=0.0057, 5000=0.0047 (USD); Product Category: Thick Film Resistors - SMD; RoHS: Details; Tolerance: 1 %; Case Code - in: 0402; Case Code - mm: 1005; Operating Temperature Range: - 55 C to + 155 C; Package / Case: 0402 (1005 metric); Packaging: Reel; Product: Thick Film Resistors SMD; Series: CRCW; Factory Pack Quantity: 10000; ComponentLink1URL: http://uk.rs-online.com/webdocs/0d98/0900766b80d98824.pdf?src-supplier=RSComponents; ComponentLink1Description: http://uk.rs-online.com/webdocs/0d98/0900766b80d98824.pdf?src-supplier=RSComponents; ComponentLink2URL: http://www.mouser.com/ds/2/427/dcrcwe3-109170.pdf?src-supplier=Mouser; ComponentLink2Description: http://www.mouser.com/ds/2/427/dcrcwe3-109170.pdf?src-supplier=Mouser; ComponentLink3URL: http://www.farnell.com/datasheets/2045673.pdf?src-supplier=Element14; ComponentLink3Description: http://www.farnell.com/datasheets/2045673.pdf?src-supplier=Element14; ComponentLink4URL: http://www.vishay.com/docs/20035/dcrcwe3.pdf?src-supplier=Digi-Key; ComponentLink4Description: http://www.vishay.com/docs/20035/dcrcwe3.pdf?src-supplier=Digi-Key; ComponentLink5URL: http://www.alliedelec.com/m/d/0c934d6939ccefa68dbe0b96d821c8cf.pdf?src-supplier=Allied+Electronics; ComponentLink5Description: http://www.alliedelec.com/m/d/0c934d6939ccefa68dbe0b96d821c8cf.pdf?src-supplier=Allied+Electronics; ComponentLink6URL: http://www.vishay.com/docs/20035/dcrcwe3.pdf?src-supplier=Avnet+Europe; ComponentLink6Description: http://www.vishay.com/docs/20035/dcrcwe3.pdf?src-supplier=Avnet+Europe; ComponentLink7URL: https://www.distrelec.biz/Web/Downloads/a_/en/flD-CRCW-e3_data_en.pdf?mime=application%2Fpdf&src-supplier=Distrelec; ComponentLink7Description: https://www.distrelec.biz/Web/Downloads/a_/en/flD-CRCW-e3_data_en.pdf?mime=application%2Fpdf&src-supplier=Distrelec; Supplier Part Number 1: 541-22.0KLCT-ND
R10 = ERJ-3EKF4023V: RES SMD 402K OHM 1% 1/10W 0603; Manufacturer: Panasonic; EDA / CAD Models: Download from Accelerated Designs; Power (Watts): 0.1W, 1/10W; Temperature Coefficient: ±100ppm/°C; Online Catalog: ERJ Series; Kits: RSM5H-ND  - RES KIT 100K-1M 1/10W 4850PCS; Other Names: ERJ-3EKF4023 ERJ3EKF4023 P402KHCT; Supplier 1: Digi-Key; Manufacturer Part Number: ERJ-3EKF4023V; Stock 1: 73987; Pricing 1: 1=0.1, 10=0.051, 100=0.0209, 1000=0.0094, 2500=0.0082 (USD); Standard Package: 1; Category: Resistors; Family: Chip Resistor - Surface Mount; Series: ERJ; Packaging: Cut Tape (CT); Tolerance: ±1%; Composition: Thick Film; Features: Automotive AEC-Q200; Operating Temperature: -55°C ~ 155°C; Package / Case: 0603 (1608 Metric); Supplier Device Package: 0603; Size / Dimension: 0.063" L x 0.031" W (1.60mm x 0.80mm); Height: 0.022" (0.55mm); Number of Terminations: 2; ComponentLink1URL: http://www.jameco.com/Jameco/Products/ProdDS/1988102.pdf?src-supplier=Jameco; ComponentLink1Description: http://www.jameco.com/Jameco/Products/ProdDS/1988102.pdf?src-supplier=Jameco; ComponentLink2URL: https://www.alliedelec.com/m/d/623f45ff1957d936ff56d46fd1c28cac.pdf?src-supplier=Allied+Electronics; ComponentLink2Description: https://www.alliedelec.com/m/d/623f45ff1957d936ff56d46fd1c28cac.pdf?src-supplier=Allied+Electronics; ComponentLink3URL: http://www.farnell.com/datasheets/1694929.pdf?src-supplier=Element14; ComponentLink3Description: http://www.farnell.com/datasheets/1694929.pdf?src-supplier=Element14; ComponentLink4URL: http://www.mouser.com/ds/2/315/AOA0000C283-1093288.pdf?src-supplier=Mouser; ComponentLink4Description: http://www.mouser.com/ds/2/315/AOA0000C283-1093288.pdf?src-supplier=Mouser; ComponentLink5URL: http://industrial.panasonic.com/www-data/pdf/AOA0000/AOA0000CE2.pdf?src-supplier=Avnet; ComponentLink5Description: http://industrial.panasonic.com/www-data/pdf/AOA0000/AOA0000CE2.pdf?src-supplier=Avnet; ComponentLink6URL: http://www.farnell.com/datasheets/1678782.pdf?src-supplier=Farnell; ComponentLink6Description: http://www.farnell.com/datasheets/1678782.pdf?src-supplier=Farnell; ComponentLink7URL: http://www.farnell.com/datasheets/1678782.pdf?src-supplier=Element14; ComponentLink7Description: http://www.farnell.com/datasheets/1678782.pdf?src-supplier=Element14; Supplier Part Number 1: P402KHCT-ND
R12 = ERJ-3EKF2700V: RES SMD 270 OHM 1% 1/10W 0603; Manufacturer: Panasonic; Rated Power: 0.1 W; Temp Coefficient: ±100 ppm/°C; Supplier 1: Digi-Key; Manufacturer Part Number: ERJ-3EKF2700V; Stock 1: 101068; Pricing 1: 1=0.1, 10=0.059, 100=0.0239, 1000=0.0107, 2500=0.0093 (USD); Size Code: 0603; Tolerance (%): ±1 %; ComponentLink1URL: http://www.farnell.com/datasheets/1911175.pdf?src-supplier=Farnell; ComponentLink1Description: http://www.farnell.com/datasheets/1911175.pdf?src-supplier=Farnell; ComponentLink2URL: http://industrial.panasonic.com/www-data/pdf/AOA0000/AOA0000CE2.pdf?src-supplier=Avnet; ComponentLink2Description: http://industrial.panasonic.com/www-data/pdf/AOA0000/AOA0000CE2.pdf?src-supplier=Avnet; ComponentLink3URL: http://www.alliedelec.com/m/d/623f45ff1957d936ff56d46fd1c28cac.pdf?src-supplier=Allied+Electronics; ComponentLink3Description: http://www.alliedelec.com/m/d/623f45ff1957d936ff56d46fd1c28cac.pdf?src-supplier=Allied+Electronics; ComponentLink4URL: http://industrial.panasonic.com/www-data/pdf/AOA0000/AOA0000CE2.pdf?src-supplier=Avnet+Europe; ComponentLink4Description: http://industrial.panasonic.com/www-data/pdf/AOA0000/AOA0000CE2.pdf?src-supplier=Avnet+Europe; ComponentLink5URL: http://industrial.panasonic.com/www-data/pdf/AOA0000/AOA0000CE2.pdf?src-supplier=Element14; ComponentLink5Description: http://industrial.panasonic.com/www-data/pdf/AOA0000/AOA0000CE2.pdf?src-supplier=Element14; ComponentLink6URL: http://industrial.panasonic.com/www-data/pdf/AOA0000/AOA0000CE2.pdf?src-supplier=Future+Electronics; ComponentLink6Description: http://industrial.panasonic.com/www-data/pdf/AOA0000/AOA0000CE2.pdf?src-supplier=Future+Electronics; ComponentLink7URL: http://www.farnell.com/datasheets/1911175.pdf?src-supplier=Element14; ComponentLink7Description: http://www.farnell.com/datasheets/1911175.pdf?src-supplier=Element14; ComponentLink8URL: http://industrial.panasonic.com/www-data/pdf/AOA0000/AOA0000CE2.pdf?src-supplier=Avnet+Asia; ComponentLink8Description: http://industrial.panasonic.com/www-data/pdf/AOA0000/AOA0000CE2.pdf?src-supplier=Avnet+Asia; ComponentLink9URL: http://www.farnell.com/datasheets/1678782.pdf?src-supplier=Element14; ComponentLink9Description: http://www.farnell.com/datasheets/1678782.pdf?src-supplier=Element14; Supplier Part Number 1: P270HCT-ND